# Altium project TPS53319DQPR.PrjPcb
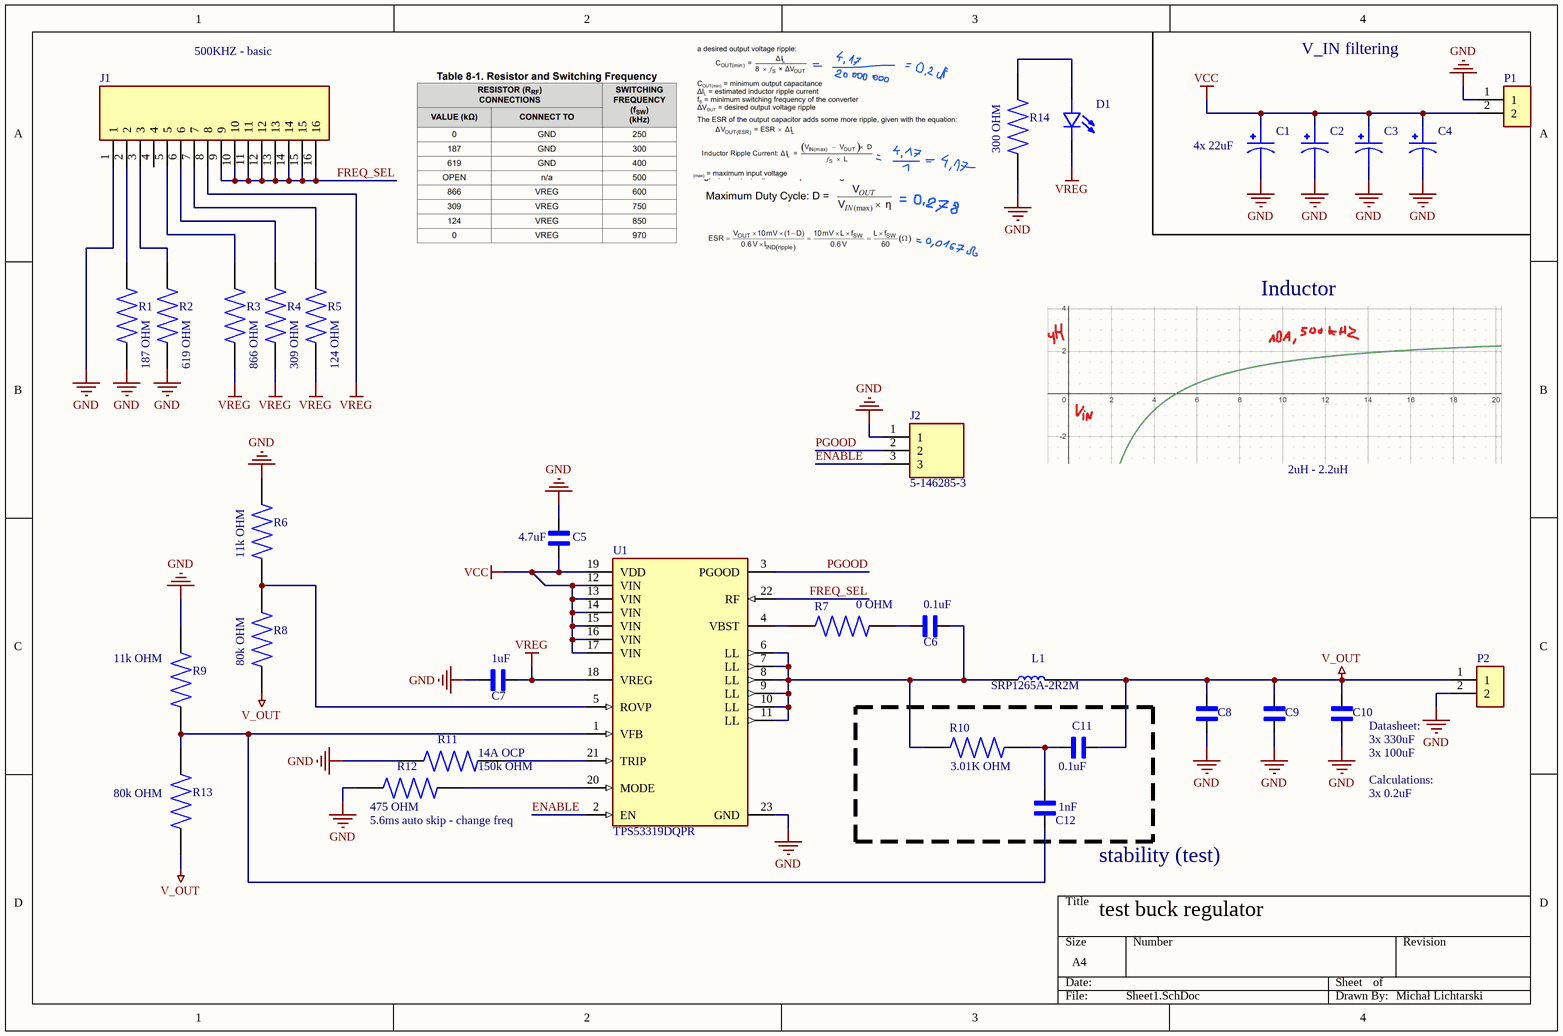
[diagram p0: Sheet1.SchDoc]
1 sheet, 33 parts. Net scope: global (net labels, ports and power ports of the same name join across sheets).
Board file: PCB1.PcbDoc

## Sheet Sheet1.SchDoc
size A4; SheetNumber: 1; SheetTotal: 1

### Parts
C1  TCJD226M035R0070  [CAPPM7343X310N]  (value not drawn)
C2  TCJD226M035R0070  [CAPPM7343X310N]  (value not drawn)
C3  TCJD226M035R0070  [CAPPM7343X310N]  (value not drawn)
C4  TCJD226M035R0070  [CAPPM7343X310N]  (value not drawn)
C5  CL21A475KLCLQNC  [CAPC2012X135N]  (value not drawn)
C6  CL10B104KB8NNNC  [CAPC1608X90N]  (value not drawn)
C7  CL21B105KBFNNNE  [CAPC2012X140N]  (value not drawn)
C8  CL32A107MPVNNNE  [ANTC3225X280N]  (value not drawn)
C9  CL32A107MPVNNNE  [ANTC3225X280N]  (value not drawn)
C10  CL32A107MPVNNNE  [ANTC3225X280N]  (value not drawn)
C11  CL10B104KB8NNNC  [CAPC1608X90N]  (value not drawn)
C12  CL10C102JB8NNNC  [CAPC1608X90N]  (value not drawn)
D1  LTST-C190GKT  [LEDC1608X35N]  (value not drawn)
J1  87227-8  [TE_87227-8]  (value not drawn)
J2  5-146285-3  [TE_5-146285-3]
L1  SRP1265A-2R2M  [IND_SRP1265A-330M]
P1  282837-2  [TE_282837-2]  (value not drawn)
P2  282837-2  [TE_282837-2]  (value not drawn)
R1  RC0603FR-07187RL  [RES_ERJ3EKF4750V]  (value not drawn)
R2  RC0603FR-07619RL  [RES_ERJ3EKF4750V]  (value not drawn)
R3  RC0603FR-07866RL  [RES_ERJ3EKF4750V]  (value not drawn)
R4  RC0603FR-07309RL  [RES_ERJ3EKF4750V]  (value not drawn)
R5  ERJ-3EKF1240V  [RES_ERJ3EKF4750V]  (value not drawn)
R6  ERJ-PB3D1102V  [RES_ERJ3EKF4750V]  (value not drawn)
R7  ERJ-3GEY0R00V  [RES_ERJ-3GEY0R00V]  (value not drawn)
R8  RC0603FR-0780K6L  [RES_ERJ3EKF4750V]  (value not drawn)
R9  ERJ-PB3D1102V  [RES_ERJ3EKF4750V]  (value not drawn)
R10  ERJ-3EKF3011V  [RES_ERJ-3GEY0R00V]  (value not drawn)
R11  RC0603FR-07150KL  [RES_ERJ3EKF4750V]  (value not drawn)
R12  ERJ-3EKF4750V  [RES_ERJ3EKF4750V]  (value not drawn)
R13  RC0603FR-0780K6L  [RES_ERJ3EKF4750V]  (value not drawn)
R14  ERJ-3GEYJ301V  [RES_ERJ3EKF4750V]  (value not drawn)
U1  TPS53319DQPR  [FP-DQP0022A-MFG]

### Nets
GND: C1.2 C2.2 C3.2 C4.2 C5.1 C7.1 C8.2 C9.2 C10.2 J1.1 J2.1 P1.1 P2.2 R1.1 R2.1 R6.2 R9.2 R11.2 R12.1 R14.1 U1.23(GND)
V_OUT: C8.1 C9.1 C10.1 C11.1 L1.2 P2.1 R8.1 R13.2
VCC: C1.1 C2.1 C3.1 C4.1 C5.2 P1.2 U1.12(VIN) U1.13(VIN) U1.14(VIN) U1.15(VIN) U1.16(VIN) U1.17(VIN) U1.19(VDD)
VREG: C7.2 D1.C J1.8 R3.1 R4.1 R5.1 U1.18(VREG)
ENABLE: J2.3 U1.2(EN)
FREQ_SEL: J1.9 J1.10 J1.11 J1.12 J1.13 J1.14 J1.15 J1.16 U1.22(RF)
PGOOD: J2.2 U1.3(PGOOD)
NetC6_1: C6.1 L1.1 R10.1 U1.6(LL) U1.7(LL) U1.8(LL) U1.9(LL) U1.10(LL) U1.11(LL)
NetC6_2: C6.2 R7.2
NetC11_2: C11.2 C12.1 R10.2
NetC12_2: C12.2 R9.1 R13.1 U1.1(VFB)
NetD1_A: D1.A R14.2
NetJ1_2: J1.2 R1.2
NetJ1_3: J1.3 R2.2
NetJ1_5: J1.5 R3.2
NetJ1_6: J1.6 R4.2
NetJ1_7: J1.7 R5.2
NetR6_1: R6.1 R8.2 U1.5(ROVP)
NetR7_1: R7.1 U1.4(VBST)
NetR11_1: R11.1 U1.21(TRIP)
NetR12_2: R12.2 U1.20(MODE)

Not connected (* = marked no-connect by the designer): J1 4

### Notes on the sheet
- 500KHZ - basic
- V_IN filtering
- (near R14) 300 OHM
- (near C1) 4x 22uF
- Inductor
- 187 OHM
- (near R2) 619 OHM
- 866 OHM
- 309 OHM
- (near R5) 124 OHM
- 2uH - 2.2uH
- (near R6) 11k OHM
- (near C5) 4.7uF
- (near R7) 0 OHM
- (near C6) 0.1uF
- (near R9) 11k OHM
- (near R8) 80k OHM
- (near C7) 1uF
- (near R11) 150k OHM
- (near R11) 14A OCP
- (near R10) 3.01K OHM
- (near C11) 0.1uF
- (near C10) 3x 330uF
- (near C10) 3x 100uF
- (near C10) Datasheet:
- Calculations:
- (near R13) 80k OHM
- (near R12) 475 OHM
- (near R12) 5.6ms auto skip - change freq
- (near C12) 1nF
- 3x 0.2uF
- stability (test)
- test buck regulator
- Michał Lichtarski

### Library data of the parts
C1-C4 = TPSD107M016S0100: CAP TANT POLY 22UF 35V 2917; MF: {'manufacturer': u'AVX'}; Package: None; Price: None; Value: *; MP: TPSD107M016S0100; Availability: Unavailable
C5 = CL21A475KLCLQNC: MLCC 0805 X5R 4.7uF Â±10% 35V T:0.85mm; MF: {'manufacturer': u'Samsung'}; Package: None; Price: None; Value: *; MP: CL21A475KLCLQNC; Availability: Unavailable
C6 C11 = CL10B104KB8NNNC: MF: {'manufacturer': u'Samsung Electro-Mechanics'}; Package: None; Price: None; Value: *; MP: CL10B104KB8NNNC; Availability: Unavailable
C7 = CL21B105KBFNNNE: Capacitor: ceramic; MLCC; 1uF; 50V; X7R; Â±10%; SMD; 0805; MF: {'manufacturer': u'Samsung Electro-Mechanics'}; Package: None; Price: None; Value: *; MP: CL21B105KBFNNNE; Availability: Unavailable
C8-C10 = CL32A107MPVNNNE: Cap Ceramic 100uF 10V X5R 20% SMD 1210 85Â°C Embossed T/R; MF: {'manufacturer': u'Samsung Electro-Mechanics'}; Package: None; Price: None; Value: *; MP: CL32A107MPVNNNE; Availability: Unavailable
C12 = CL10B104KB8NNNC: CAP CER 1000PF 50V C0G/NP0 0603; MF: {'manufacturer': u'Samsung Electro-Mechanics'}; Package: None; Price: None; Value: *; MP: CL10B104KB8NNNC; Availability: Unavailable
D1 = LTST-C190GKT: LED; SMD; 0603; Green; 18-180mcd; 1.6x0.8x0.8mm; 130Â°; 1.6Ã·2.4V; 20mA <a href="https://pricing.snapeda.com/parts/LTST-C190GKT/Lite-On%20Inc./view-part?ref=eda">Check availability</a>; MF: {'manufacturer': u'Lite-On Inc.'}; Package: None; Price: None; Value: *; MP: LTST-C190GKT; Availability: Unavailable
J1 = 87227-8: MF: {'manufacturer': u'TE Connectivity'}; Package: None; Price: None; Value: *; MP: 87227-8; Availability: Unavailable
J2 = 5-146285-3: MF: {'manufacturer': u'TE Connectivity'}; Package: None; Price: None; Value: *; MP: 5-146285-3; Availability: Unavailable
L1 = SRP1265A-330M: Inductor Power Shielded Wirewound 33uH 20% 100KHz Carbonyl Powder 8A 58mOhm DCR Automotive T/R; MF: {'manufacturer': u'Bourns'}; Package: None; Price: None; Value: *; MP: SRP1265A-330M; Availability: Unavailable
P1 P2 = 282837-2: TERM BLOCK 5.08MM 2POS SIDE ENTY; MF: {'manufacturer': u'TE Connectivity'}; Package: None; Price: None; Value: *; MP: 282837-2; Availability: Unavailable
R1 = ERJ3EKF4750V: RES 187 OHM 1% 1/10W 0603; MF: {'manufacturer': u'Panasonic'}; Package: None; Price: None; Value: *; MP: ERJ3EKF4750V; Availability: Unavailable
R2 = ERJ3EKF4750V: RES 619 OHM 1% 1/10W 0603; MF: {'manufacturer': u'Panasonic'}; Package: None; Price: None; Value: *; MP: ERJ3EKF4750V; Availability: Unavailable
R3 = ERJ3EKF4750V: RES 866 OHM 1% 1/10W 0603; MF: {'manufacturer': u'Panasonic'}; Package: None; Price: None; Value: *; MP: ERJ3EKF4750V; Availability: Unavailable
R4 = ERJ3EKF4750V: RES 309 OHM 1% 1/10W 0603; MF: {'manufacturer': u'Panasonic'}; Package: None; Price: None; Value: *; MP: ERJ3EKF4750V; Availability: Unavailable
R5 = ERJ3EKF4750V: RES SMD 124 OHM 1% 1/10W 0603; MF: {'manufacturer': u'Panasonic'}; Package: None; Price: None; Value: *; MP: ERJ3EKF4750V; Availability: Unavailable
R6 R9 = ERJ3EKF4750V: RES SMD 11K OHM 0.5% 1/5W 0603; MF: {'manufacturer': u'Panasonic'}; Package: None; Price: None; Value: *; MP: ERJ3EKF4750V; Availability: Unavailable
R7 = ERJ-3GEY0R00V: <a href="https://pricing.snapeda.com/parts/ERJ-3GEY0R00V/Panasonic/view-part?ref=eda">Check availability</a>; MF: {'manufacturer': u'Panasonic'}; Package: None; Price: None; Value: *; MP: ERJ-3GEY0R00V; Availability: Unavailable
R8 R13 = ERJ3EKF4750V: RES 80.6K OHM 1% 1/10W 0603; MF: {'manufacturer': u'Panasonic'}; Package: None; Price: None; Value: *; MP: ERJ3EKF4750V; Availability: Unavailable
R10 = ERJ-3GEY0R00V: RES SMD 3.01K OHM 1% 1/10W 0603; MF: {'manufacturer': u'Panasonic'}; Package: None; Price: None; Value: *; MP: ERJ-3GEY0R00V; Availability: Unavailable
R11 = ERJ3EKF4750V: RES 150K OHM 1% 1/10W 0603; MF: {'manufacturer': u'Panasonic'}; Package: None; Price: None; Value: *; MP: ERJ3EKF4750V; Availability: Unavailable
R12 = ERJ3EKF4750V: RES SMD 475 OHM 1% 1/10W 0603; MF: {'manufacturer': u'Panasonic'}; Package: None; Price: None; Value: *; MP: ERJ3EKF4750V; Availability: Unavailable
R14 = ERJ3EKF4750V: RES SMD 300 OHM 5% 1/10W 0603; MF: {'manufacturer': u'Panasonic'}; Package: None; Price: None; Value: *; MP: ERJ3EKF4750V; Availability: Unavailable
U1 = CMP-04918-000329-1: IC REG BUCK ADJUSTABLE 14A 22SON; Output Voltage: 5.5V; Output Configuration: Positive; Quiescent Current: 320uA; Number of Outputs: 1; Min Output Voltage: 600mV; Max Input Voltage: 22V; Switching Frequency: 1MHz; Min Input Voltage: 1.5V; Efficiency: 91%; Synchronous Rectifier: Yes; Output Type: Adjustable; Series: D-CAP™, Eco-Mode™; Max Output Voltage: 5.5V; Case/Package: SON; Packaging: Tape and Reel; Lead Free: Contains Lead; Number of Pins: 22; Output Current: 14A; Min Operating Temperature: -40°C; Mount: Surface Mount; Radiation Hardening: No; Contact Plating: Gold; RoHS Compliant: Yes; Max Operating Temperature: 85°C; Max Output Current: 14A; Package Quantity: 2500